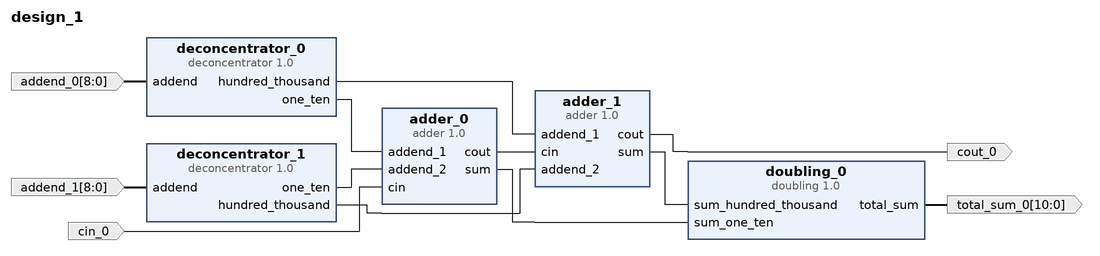
[diagram p0: block diagram of the top level]
# Vivado block design design_1, xc7a35tftg256-1, Vivado 2018.3
create_bd_design design_1

create_bd_port -dir O cout_0
create_bd_port -dir O -from 10 -to 0 total_sum_0
create_bd_port -dir I cin_0
create_bd_port -dir I -from 8 -to 0 addend_0
create_bd_port -dir I -from 8 -to 0 addend_1

create_bd_cell -type ip -vlnv xilinx.com:user:adder:1.0 adder_0
create_bd_cell -type ip -vlnv xilinx.com:user:adder:1.0 adder_1
create_bd_cell -type ip -vlnv xilinx.com:user:deconcentrator:1.0 deconcentrator_0
create_bd_cell -type ip -vlnv xilinx.com:user:doubling:1.0 doubling_0
create_bd_cell -type ip -vlnv xilinx.com:user:deconcentrator:1.0 deconcentrator_1

# ---- connections ----

connect_bd_net [get_bd_pins deconcentrator_0/one_ten] [get_bd_pins adder_0/addend_1]
connect_bd_net [get_bd_pins deconcentrator_1/one_ten] [get_bd_pins adder_0/addend_2]
connect_bd_net [get_bd_pins adder_0/sum] [get_bd_pins doubling_0/sum_one_ten]
connect_bd_net [get_bd_pins doubling_0/total_sum] [get_bd_ports total_sum_0]
connect_bd_net -net cin_0_1 [get_bd_ports cin_0] [get_bd_pins adder_0/cin]
connect_bd_net -net addend_0_1 [get_bd_ports addend_0] [get_bd_pins deconcentrator_0/addend]
connect_bd_net -net addend_1_1 [get_bd_ports addend_1] [get_bd_pins deconcentrator_1/addend]
connect_bd_net [get_bd_pins deconcentrator_0/hundred_thousand] [get_bd_pins adder_1/addend_1]
connect_bd_net [get_bd_pins adder_0/cout] [get_bd_pins adder_1/cin]
connect_bd_net [get_bd_pins deconcentrator_1/hundred_thousand] [get_bd_pins adder_1/addend_2]
connect_bd_net [get_bd_pins adder_1/cout] [get_bd_ports cout_0]
connect_bd_net [get_bd_pins adder_1/sum] [get_bd_pins doubling_0/sum_hundred_thousand]

validate_bd_design
save_bd_design
